# Altium schematic sheet KV2_MotionA9A.SchDoc
size A3; PageSetup: Record=PageOptions|CenterHorizontal=True|CenterVertical=True|PrintScale=1.00|XCorrection=1.00|YCorrection=1.00|PrintKind=2|BorderSize=5000000|LeftOffset=0|BottomOffset=0|Orientation=2|PaperLength=1000|PaperWidth=1000|Scale=100|PaperSource=7|PrintQuality=-4|MediaType=1|DitherType=10|PaperKind=A3|PrintScaleMode=1
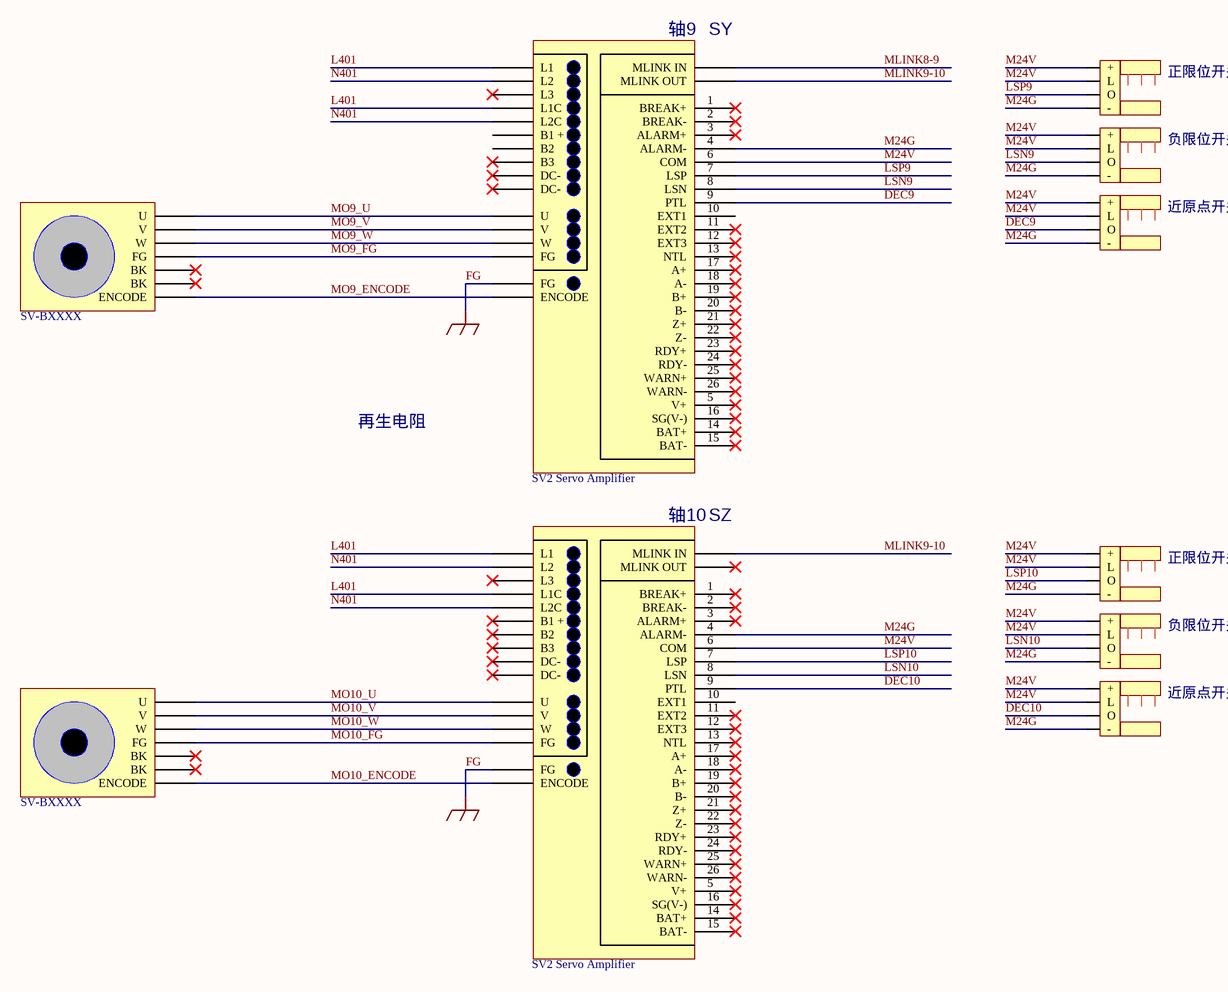
[diagram p0: KV2_MotionA9A.SchDoc]

## Parts
(Parts that share a designator on the sheet are numbered #1, #2 ... from top to bottom, then left to right.)
*#1  SV2 Servo Amplifier
*#2  SV-BXXXX
*#3  SV2 Servo Amplifier
*#4  SV-BXXXX
原点光纤传感器#1  OMRON  E3X-HD  (value not drawn)
原点光纤传感器#2  OMRON  E3X-HD  (value not drawn)
原点光纤传感器#3  OMRON  E3X-HD  (value not drawn)
原点光纤传感器#4  OMRON  E3X-HD  (value not drawn)
原点光纤传感器#5  OMRON  E3X-HD  (value not drawn)
原点光纤传感器#6  OMRON  E3X-HD  (value not drawn)

## Nets
FG: *#1.X43(FG) *#3.X43(FG)  [also labelled GND]
DEC9: *#1.9(PTL) 原点光纤传感器#3.91(O)
DEC10: *#3.9(PTL) 原点光纤传感器#6.91(O)
L401: *#1.X34(L1) *#1.X37(L1C) *#3.X34(L1) *#3.X37(L1C)
LSN9: *#1.8(LSN) 原点光纤传感器#2.91(O)
LSN10: *#3.8(LSN) 原点光纤传感器#5.91(O)
LSP9: *#1.7(LSP) 原点光纤传感器#1.91(O)
LSP10: *#3.7(LSP) 原点光纤传感器#4.91(O)
M24G: *#1.4(ALARM-) *#3.4(ALARM-) 原点光纤传感器#1.92(-) 原点光纤传感器#2.92(-) 原点光纤传感器#3.92(-) 原点光纤传感器#4.92(-) 原点光纤传感器#5.92(-) 原点光纤传感器#6.92(-)
M24V: *#1.6(COM) *#3.6(COM) 原点光纤传感器#1.89(+) 原点光纤传感器#1.90(L) 原点光纤传感器#2.89(+) 原点光纤传感器#2.90(L) 原点光纤传感器#3.89(+) 原点光纤传感器#3.90(L) 原点光纤传感器#4.89(+) 原点光纤传感器#4.90(L) 原点光纤传感器#5.89(+) 原点光纤传感器#5.90(L) 原点光纤传感器#6.89(+) 原点光纤传感器#6.90(L)
MLINK8-9: *#1.X44(MLINK_IN)
MLINK9-10: *#1.X44(MLINK_OUT) *#3.X44(MLINK_IN)
MO9_ENCODE: *#1.X44(ENCODE) *#2.29(ENCODE)
MO9_FG: *#1.X43(FG) *#2.29(FG)
MO9_U: *#1.X43(DC-) *#2.27(U)
MO9_V: *#1.X43(V) *#2.28(V)
MO9_W: *#1.X43(W) *#2.29(W)
MO10_ENCODE: *#3.X44(ENCODE) *#4.29(ENCODE)
MO10_FG: *#3.X43(FG) *#4.29(FG)
MO10_U: *#3.X43(DC-) *#4.27(U)
MO10_V: *#3.X43(V) *#4.28(V)
MO10_W: *#3.X43(W) *#4.29(W)
N401: *#1.X35(L2) *#1.X38(L2C) *#3.X35(L2) *#3.X38(L2C)

Not connected (* = marked no-connect by the designer): *#1 1(BREAK+)* 2(BREAK-)* 3(ALARM+)* 5(V+)* 10(EXT1) 11(EXT2)* 12(EXT3)* 13(NTL)* 14(BAT+)* 15(BAT-)* 16(SG(V-))* 17(A+)* 18(A-)* 19(B+)* 20(B-)* 21(Z+)* 22(Z-)* 23(RDY+)* 24(RDY-)* 25(WARN+)* 26(WARN-)* X36(L3)* X39(B1_+) X40(B2) X41(B3)* X42(DC-)*; *#2 30(BK)* 31(BK)*; *#3 1(BREAK+)* 2(BREAK-)* 3(ALARM+)* 5(V+)* 10(EXT1) 11(EXT2)* 12(EXT3)* 13(NTL)* 14(BAT+)* 15(BAT-)* 16(SG(V-))* 17(A+)* 18(A-)* 19(B+)* 20(B-)* 21(Z+)* 22(Z-)* 23(RDY+)* 24(RDY-)* 25(WARN+)* 26(WARN-)* X36(L3)* X39(B1_+)* X40(B2)* X41(B3)* X42(DC-)*; *#4 30(BK)* 31(BK)*

## Notes on the sheet
- (near *#1) 轴9
- (near *#1) SY
- 正限位开关
- 负限位开关
- 近原点开关
- 再生电阻
- (near *#3) 轴10
- (near *#3) SZ

## Library data of the parts
原点光纤传感器#1-原点光纤传感器#6 = OMRON_EE-SX671